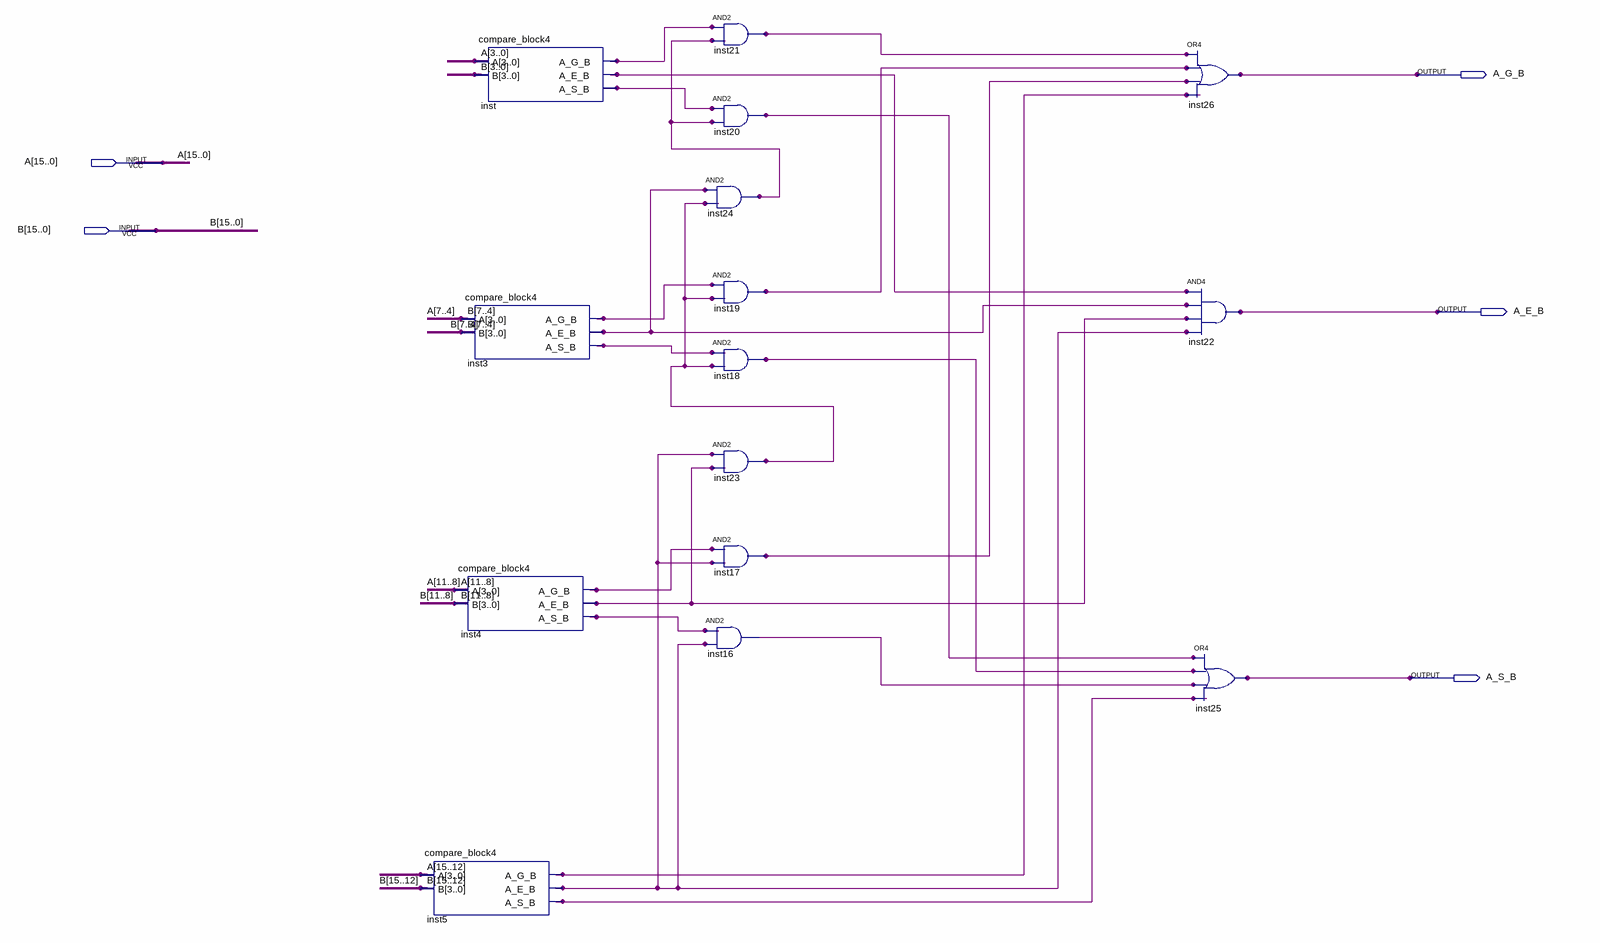
[diagram p0: schematic sheet]
// Quartus schematic compare_block16.bdf as structural Verilog: 15 symbols, 5 pins
module compare_block16 (
  input  [15:0] A,
  input  [15:0] B,
  output A_G_B,
  output A_E_B,
  output A_S_B
);

  wire inst3_a_e_b, inst3_a_g_b, inst3_a_s_b, inst4_a_e_b, inst4_a_g_b, inst4_a_s_b, inst5_a_e_b,
       inst5_a_g_b, inst5_a_s_b, inst16_out, inst17_out, inst18_out, inst19_out, inst20_out, inst21_out,
       inst23_out, inst24_out, inst_a_e_b, inst_a_g_b, inst_a_s_b;

  compare_block4 inst5 (.A(A[15:12]), .B(B[15:12]), .A_G_B(inst5_a_g_b), .A_E_B(inst5_a_e_b), .A_S_B(inst5_a_s_b));
  compare_block4 inst (.A(A[3:0]), .B(B[3:0]), .A_G_B(inst_a_g_b), .A_E_B(inst_a_e_b), .A_S_B(inst_a_s_b));
  compare_block4 inst3 (.A(A[7:4]), .B(A[7:4]), .A_G_B(inst3_a_g_b), .A_E_B(inst3_a_e_b), .A_S_B(inst3_a_s_b));
  compare_block4 inst4 (.A(A[11:8]), .B(B[11:8]), .A_G_B(inst4_a_g_b), .A_E_B(inst4_a_e_b), .A_S_B(inst4_a_s_b));
  and inst21 (inst21_out, inst_a_g_b, inst24_out);
  and inst20 (inst20_out, inst_a_s_b, inst24_out);
  and inst24 (inst24_out, inst3_a_e_b, inst23_out);
  and inst19 (inst19_out, inst3_a_g_b, inst23_out);
  and inst18 (inst18_out, inst3_a_s_b, inst23_out);
  and inst23 (inst23_out, inst5_a_e_b, inst4_a_e_b);
  and inst17 (inst17_out, inst4_a_g_b, inst5_a_e_b);
  and inst16 (inst16_out, inst4_a_s_b, inst5_a_e_b);
  or inst26 (A_G_B, inst21_out, inst19_out, inst17_out, inst5_a_g_b);
  and inst22 (A_E_B, inst_a_e_b, inst3_a_e_b, inst4_a_e_b, inst5_a_e_b);
  or inst25 (A_S_B, inst20_out, inst18_out, inst16_out, inst5_a_s_b);

  assign B[7:4] = A[7:4];
endmodule
